# EasyEDA schematic ESP32-EDU-BOARD V0.1.json
TITLE: ESP32-EDU-BOARD V0.1; REV: 1.0; Date: 2023-03-09; Sheet: 1/1; Drawn By: wuxiuxiu; Company: 工训A413+太原青禾之道
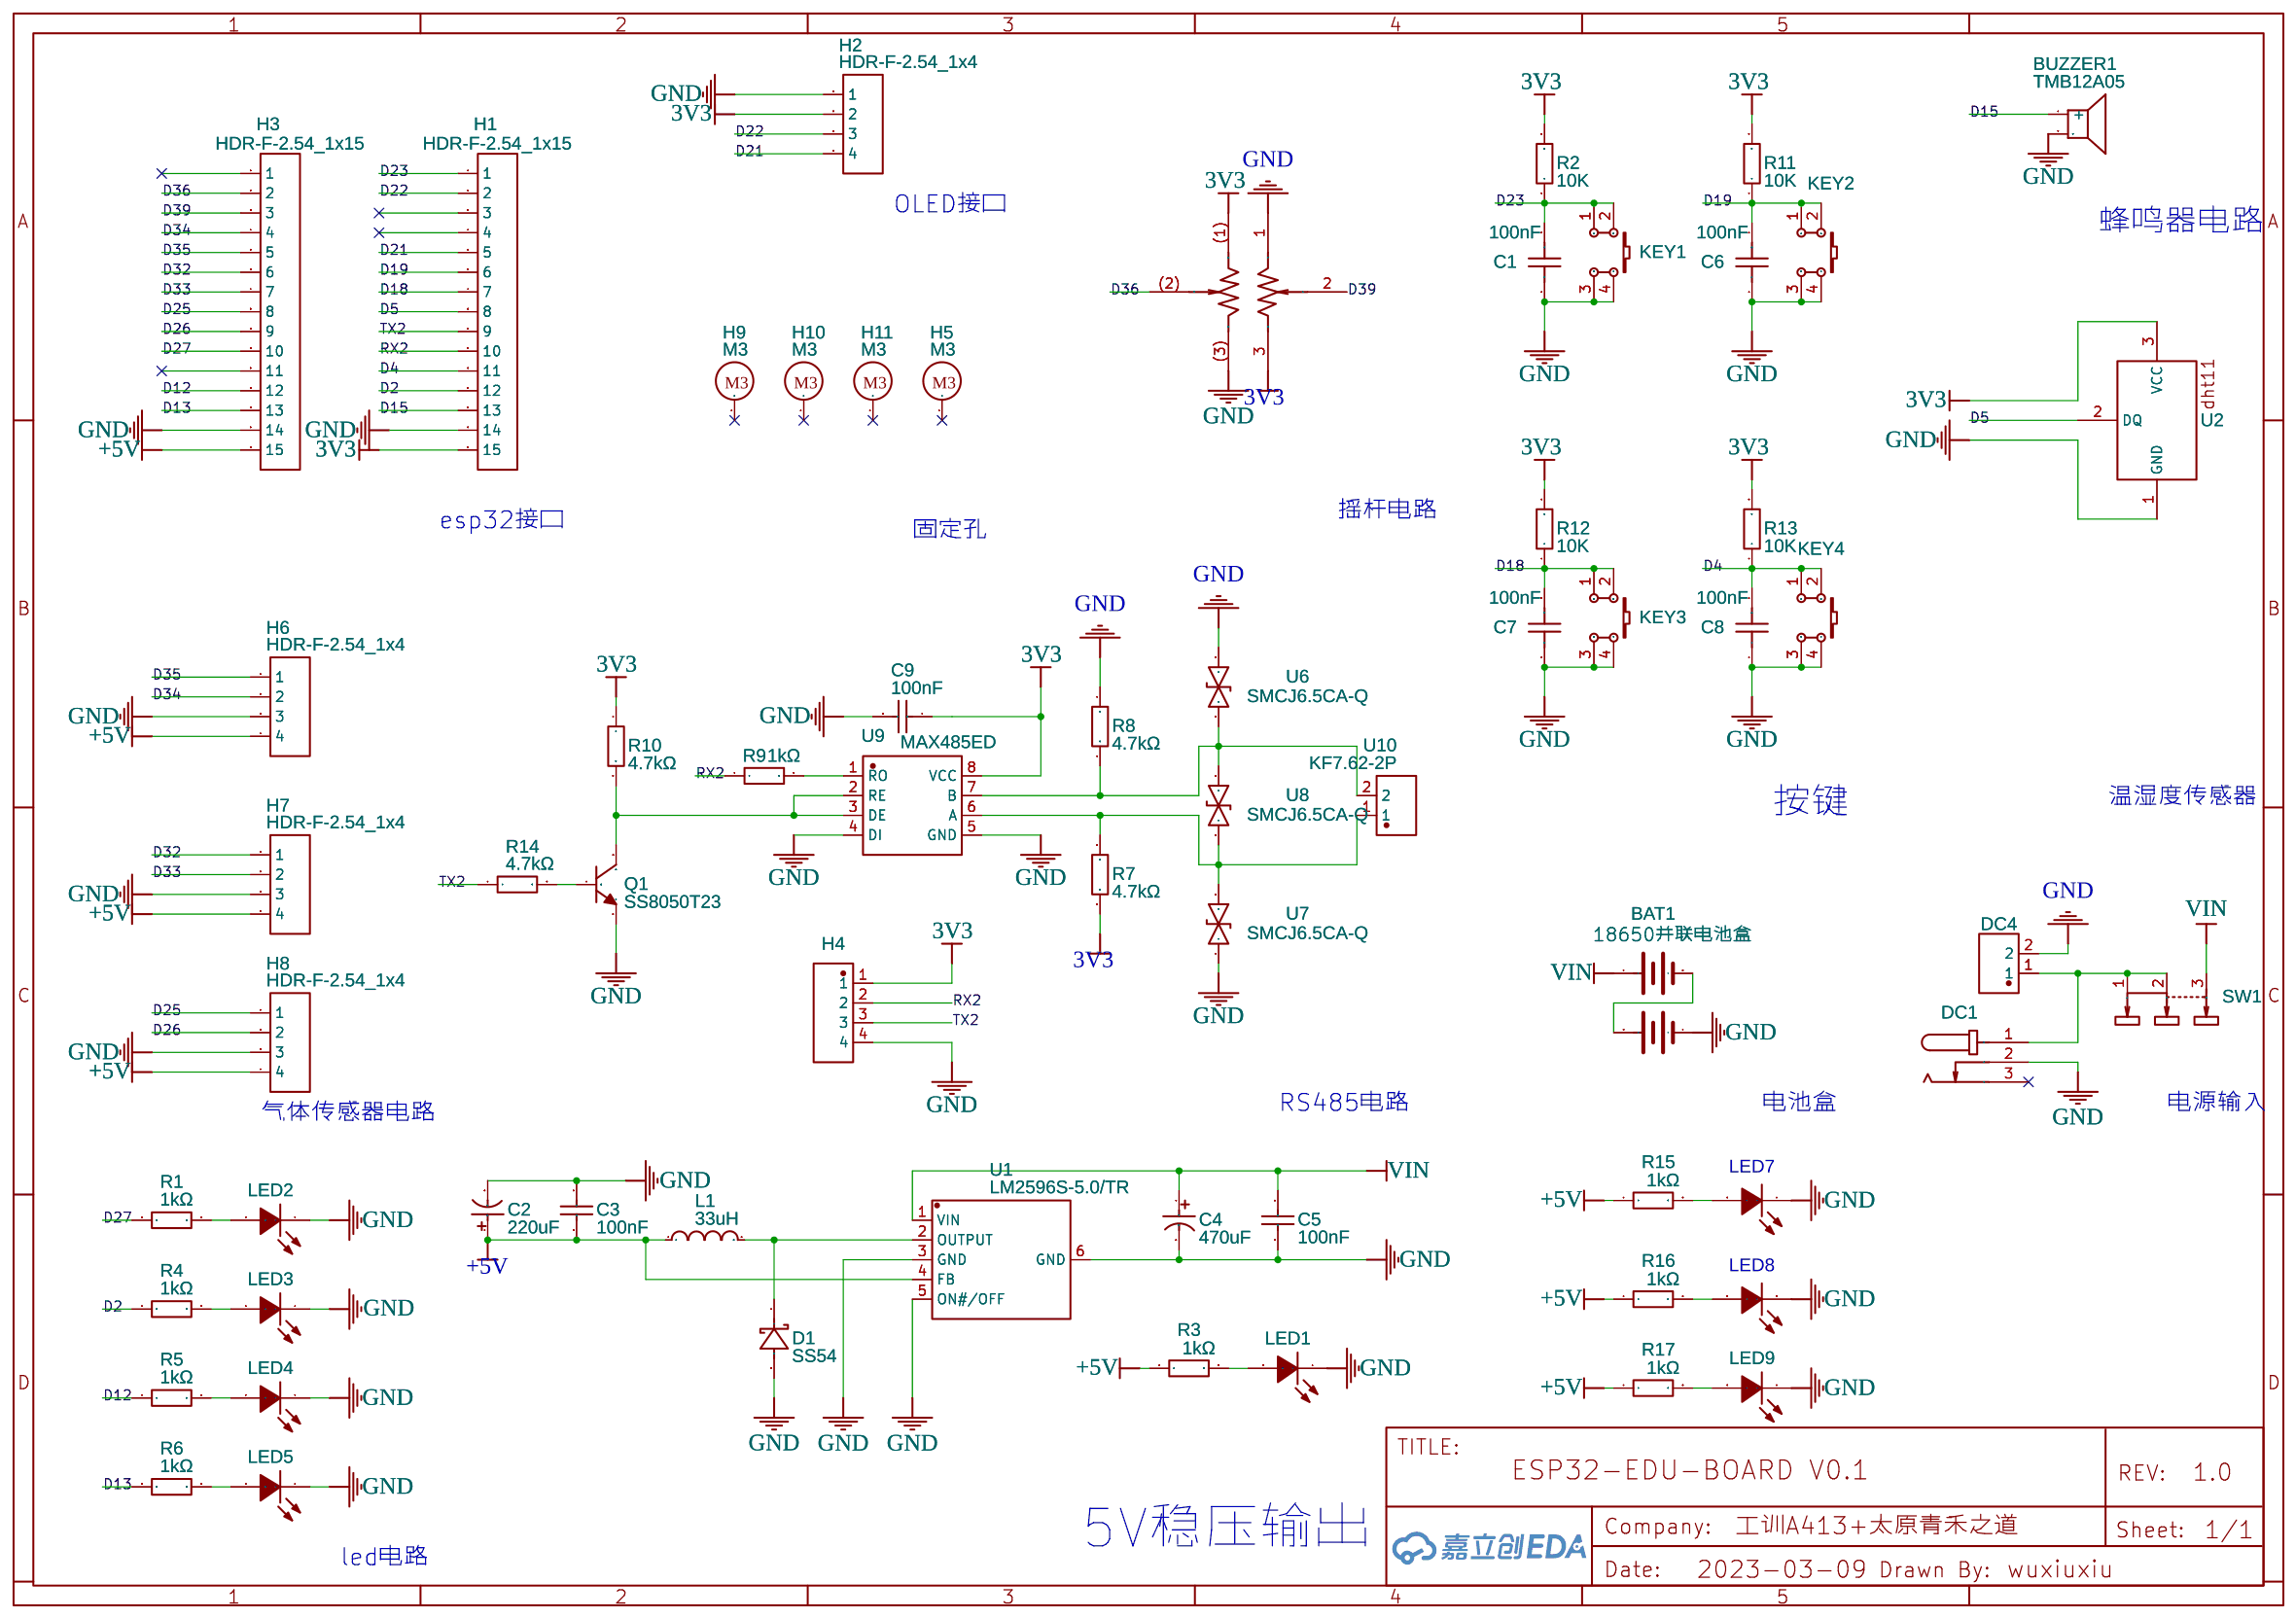
[diagram p0: schematic sheet]

## Parts
BAT1  18650并联电池盒  [BAT-TH_18650-2]
BUZZER1  TMB12A05  [BUZ-TH_BD12.0-P7.60-D0.6-FD]
C1  100nF  [C0603]
C2  220uF  [CAP-SMD_BD6.3-L6.6-W6.6-FD]
C3  100nF  [C0805]
C4  470uF  [CAP-SMD_BD8.0-L8.3-W8.3-FD]
C5  100nF  [C0805]
C6  100nF  [C0603]
C7  100nF  [C0603]
C8  100nF  [C0603]
C9  100nF  [C0805]
D1  SS54  [SMA_L4.3-W2.6-LS5.0-RD]
DC1  KH-DC-005-2.5  [DC-IN-TH_KH-DC-005-2.5]
DC4  KF301-5.0-2P  [CONN-TH_P5.00_KF301-5.0-2P]
H1  HDR-F-2.54_1x15  [HDR-F-2.54_1X15]
H2  HDR-F-2.54_1x4  [HDR-F-2.54_1X4]
H3  HDR-F-2.54_1x15  [HDR-F-2.54_1X15]
H4  12251104CNSNS295001  [HDR-TH_4P-P2.54-V-M-1]
H5  M3  [M3]
H6  HDR-F-2.54_1x4  [HDR-F-2.54_1X4]
H7  HDR-F-2.54_1x4  [HDR-F-2.54_1X4]
H8  HDR-F-2.54_1x4  [HDR-F-2.54_1X4]
H9  M3  [M3]
H10  M3  [M3]
H11  M3  [M3]
KEY1  K4-6×6_SMD  [KEY-SMD_4P-L6.0-W6.0-P3.90-LS10.0]
KEY2  K4-6×6_SMD  [KEY-SMD_4P-L6.0-W6.0-P3.90-LS10.0]
KEY3  K4-6×6_SMD  [KEY-SMD_4P-L6.0-W6.0-P3.90-LS10.0]
KEY4  K4-6×6_SMD  [KEY-SMD_4P-L6.0-W6.0-P3.90-LS10.0]
L1  33uH  [IND-SMD_L12.0-W12.0]
LED1  FC-2012HRK-620D  [LED0805-RD_RED]
LED2  FC-2012HRK-620D  [LED0805-RD_RED]
LED3  FC-2012HRK-620D  [LED0805-RD_RED]
LED4  FC-2012HRK-620D  [LED0805-RD_RED]
LED5  FC-2012HRK-620D  [LED0805-RD_RED]
LED7  FC-2012HRK-620D  [LED0805-RD_RED]
LED8  FC-2012HRK-620D  [LED0805-RD_RED]
LED9  FC-2012HRK-620D  [LED0805-RD_RED]
Q1  SS8050T23  [SOT-23-3_L2.9-W1.3-P1.90-LS2.4-BR]
R1  1kΩ  [R0805]
R2  10K  [R0603]
R3  1kΩ  [R0805]
R4  1kΩ  [R0805]
R5  1kΩ  [R0805]
R6  1kΩ  [R0805]
R7  4.7kΩ  [R0805]
R8  4.7kΩ  [R0805]
R9  1kΩ  [R0805]
R10  4.7kΩ  [R0805]
R11  10K  [R0603]
R12  10K  [R0603]
R13  10K  [R0603]
R14  4.7kΩ  [R0805]
R15  1kΩ  [R0805]
R16  1kΩ  [R0805]
R17  1kΩ  [R0805]
SW1  SS-12D10L3  [SW-TH_SS-12D10L3]
SW2  摇杆电位器 4方向 16*16 COPY COPY  [SW-TH_3D_1616_4]
U1  LM2596S-5.0/TR  [TO-263-5_L10.2-W8.6-P1.70-LS14.4-TL]
U2  华为牛逼3  [DHT11]
U6  SMCJ6.5CA-Q  [SMC_L6.9-W5.9-LS7.9-BI]
U7  SMCJ6.5CA-Q  [SMC_L6.9-W5.9-LS7.9-BI]
U8  SMCJ6.5CA-Q  [SMC_L6.9-W5.9-LS7.9-BI]
U9  MAX485ED  [SOP-8_L4.9-W3.9-P1.27-LS6.0-BL]
U10  KF7.62-2P  [CONN-TH_KF7.62-2P]

## Library data of the parts
BAT1 = 18650并联电池盒: Supplier: LCSC; Supplier Part: C9900010344; Manufacturer: null; link: https://atta.szlcsc.comnull; JLCPCB Part Class: Extended Part; Contributor: LCSC
BUZZER1 = TMB12A05: Supplier: LCSC; Manufacturer: 华能; Supplier Part: C96093; JLCPCB Part Class: Extended Part; Frequency: 2300Hz
C1 C6-C8 = CC0603KRX7R9BB104: Supplier: LCSC; Manufacturer: YAGEO; Supplier Part: C14663; JLCPCB Part Class: Basic Part; Package Display: No
C2 = RT1A221M0605: Supplier: LCSC; Supplier Part: C267466; Manufacturer: ROQANG; Contributor: LCSC; JLCPCB Part Class: Extended Part
C3 C5 C9 = CL21B104KBCNNNC: Supplier: LCSC; Manufacturer: SAMSUNG; Supplier Part: C1711; JLCPCB Part Class: Extended Part
C4 = RVE1C471M0810: Supplier: LCSC; Manufacturer: ROQANG; Supplier Part: C107396; JLCPCB Part Class: Extended Part
D1 = SS54_C727065: Supplier: LCSC; Supplier Part: C727065; Manufacturer: TWGMC; Contributor: LCSC; JLCPCB Part Class: Extended Part
DC1 = KH-DC-005-2.5: Supplier: LCSC; Supplier Part: C2847170; Manufacturer: kinghelm(金航标); Contributor: LCSC; JLCPCB Part Class: Extended Part
DC4 = KF301-5.0-2P: Supplier: LCSC; Supplier Part: C474881; Manufacturer: Cixi Kefa Elec; Contributor: LCSC; JLCPCB Part Class: Extended Part
H1 H3 = HDR-F-2.54_1x15: Supplier Part: C124408; Supplier: LCSC; Contributor: LCEDA_Lib
H2 H6-H8 = HDR-F-2.54_1x4: Supplier Part: C225501; Supplier: LCSC; Contributor: LCEDA_Lib
H4 = 12251104CNSNS295001: Supplier: LCSC; Supplier Part: C355292; Manufacturer: JILN(锦凌); Contributor: LCSC; JLCPCB Part Class: Extended Part
H5 H9-H11 = M3: Contributor: lvxiaojia20
KEY1-KEY4 = K4-6×6_SMD: Supplier Part: C191626; Supplier: LCSC; Manufacturer: 韩国韩荣; Manufacturer Part: K2-6639SP-D4SC-04
L1 = SLH1207S330MTT: Supplier: LCSC; Supplier Part: C181844; Manufacturer: Sunltech Tech; Contributor: LCSC; JLCPCB Part Class: Extended Part
LED1-LED5 LED7-LED9 = FC-2012HRK-620D: Supplier: LCSC; Manufacturer: NATIONSTAR; Supplier Part: C84256; JLCPCB Part Class: Basic Part
Q1 = SS8050T23: Supplier: LCSC; Supplier Part: C2939671; Manufacturer: Me-TECH(美台高科); Contributor: LCSC; JLCPCB Part Class: Extended Part
R1 R3-R6 R15-R17 = RS-05K102JT: Supplier: LCSC; Manufacturer: FH; Supplier Part: C115302; Resistance (Ohms): 1K; JLCPCB Part Class: Extended Part
R2 R11-R13 = 0603WAF1002T5E: Supplier: LCSC; Manufacturer: UniOhm; Supplier Part: C25804; JLCPCB Part Class: Basic Part; Package Display: No
R7 R8 R10 R14 = PTFR0805B4K70N9: Supplier: LCSC; Supplier Part: C328444; Manufacturer: RESI(开步睿思）; Resistance (Ohms): 4.7K; Contributor: LCSC; JLCPCB Part Class: Extended Part
R9 = PTFR0805B1K00N9: Supplier: LCSC; Supplier Part: C328437; Manufacturer: RESI(开步睿思）; Resistance (Ohms): 1K; Contributor: LCSC; JLCPCB Part Class: Extended Part
SW1 = SS-12D10L3: Supplier: LCSC; Supplier Part: C319013; Manufacturer: XKB Enterprise; Contributor: LCSC; JLCPCB Part Class: Extended Part
SW2 = 摇杆电位器 4方向 16*16 COPY COPY: Supplier: LCSC; Manufacturer: HRO; Manufacturer Part: 3D161; Contributor: LCSC; Supplier Part: C92593
U1 = LM2596S-5.0/TR: Supplier: LCSC; Supplier Part: C194349; Manufacturer: HGSEMI; Contributor: LCSC; JLCPCB Part Class: Extended Part
U2 = 华为牛逼3: sourceId: wQqNnXVvs; Supplier: SeeedStudio; Contributor: iphone.mini; Package Display: No
U6-U8 = SMCJ6.5CA-Q: Supplier: LCSC; Supplier Part: C1517967; Manufacturer: BOURNS; link: https://atta.szlcsc.com/upload/public/pdf/source/20210426/D786806ACD0BF5AFE18710A9F9466ADB.pdf; Contributor: lcsc
U9 = MAX485ED: Supplier: LCSC; Supplier Part: C481667; Manufacturer: HTC; Contributor: LCSC; JLCPCB Part Class: Extended Part
U10 = KF7.62-2P: Supplier: LCSC; Supplier Part: C707824; Manufacturer: KEFA(科发); Contributor: LCSC; JLCPCB Part Class: Extended Part

## Nets
3V3: C9.1 H1.15 H2.2 H4.1 R2.2 R7.2 R10.1 R11.2 R12.2 R13.2 SW2.3 SW2.(1) U2.3(VCC) U9.8(VCC)
+5V: C2.1 C3.1 H3.15 H6.4 H7.4 H8.4 L1.1 R3.1 R15.1 R16.1 R17.1 U1.4(FB)
GND: BAT1.4(-) BUZZER1.2 C1.1 C2.2 C3.2 C4.2 C5.1 C6.1 C7.1 C8.1 C9.2 D1.2 DC1.2 DC4.2 H1.14 H2.1 H3.14 H4.4 H6.3 H7.3 H8.3 KEY1.3 KEY1.4 KEY2.3 KEY2.4 KEY3.3 KEY3.4 KEY4.3 KEY4.4 LED1.1(-) LED2.1(-) LED3.1(-) LED4.1(-) LED5.1(-) LED7.1(-) LED8.1(-) LED9.1(-) Q1.2(E) R8.1 SW2.1 SW2.(3) U1.3(GND) U1.5(ON#/OFF) U1.6(GND) U2.1(GND) U6.2(A) U7.1(K) U9.4(DI) U9.5(GND)
VIN: BAT1.1(+) C4.1 C5.2 SW1.3 U1.1(VIN)
D2: H1.12 R4.1
D4: C8.2 H1.11 KEY4.1 KEY4.2 R13.1
D5: H1.8 U2.2(DQ)
D12: H3.12 R5.1
D13: H3.13 R6.1
D15: BUZZER1.1(+) H1.13
D18: C7.2 H1.7 KEY3.1 KEY3.2 R12.1
D19: C6.2 H1.6 KEY2.1 KEY2.2 R11.1
D21: H1.5 H2.4
D22: H1.2 H2.3
D23: C1.2 H1.1 KEY1.1 KEY1.2 R2.1
D25: H3.8 H8.1
D26: H3.9 H8.2
D27: H3.10 R1.1
D32: H3.6 H7.1
D33: H3.7 H7.2
D34: H3.4 H6.2
D35: H3.5 H6.1
D36: H3.2 SW2.(2)
D39: H3.3 SW2.2
RX2: H1.10 H4.2 R9.1
TX2: H1.9 H4.3 R14.1
Net-(BAT1-2): BAT1.2(+) BAT1.3(-)
Net-(D1-1): D1.1 L1.2 U1.2(OUTPUT)
Net-(DC1-1): DC1.1 DC4.1 SW1.1 SW1.2
Net-(LED1-2): LED1.2(+) R3.2
Net-(LED2-2): LED2.2(+) R1.2
Net-(LED3-2): LED3.2(+) R4.2
Net-(LED4-2): LED4.2(+) R5.2
Net-(LED5-2): LED5.2(+) R6.2
Net-(LED7-2): LED7.2(+) R15.2
Net-(LED8-2): LED8.2(+) R16.2
Net-(LED9-2): LED9.2(+) R17.2
Net-(Q1-1): Q1.1(B) R14.2
Net-(Q1-3): Q1.3(C) R10.2 U9.2(RE) U9.3(DE)
Net-(R7-1): R7.1 U7.2(A) U8.1(K) U9.6(A) U10.1
Net-(R8-2): R8.2 U6.1(K) U8.2(A) U9.7(B) U10.2
Net-(R9-2): R9.2 U9.1(RO)

Not connected (* = marked no-connect by the designer): DC1 3*; H1 3 4; H3 1 11; H5 1*; H9 1*; H10 1*; H11 1*

## Notes on the sheet
- OLED接口
- 蜂鸣器电路
- esp32接口
- 摇杆电路
- 固定孔
- 按键
- 温湿度传感器
- RS485电路
- 电池盒
- 电源输入
- 气体传感器电路
- LED7
- LED8
- 5V稳压输出
- led电路
